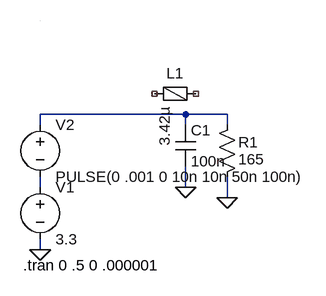
[diagram p0: schematic Draft2.asc]
Draft2.asc, the LTspice schematic file:
Version 4
SHEET 1 880 680
WIRE 224 144 0 144
WIRE 288 144 224 144
WIRE 0 160 0 144
WIRE 224 160 224 144
WIRE 288 160 288 144
WIRE 0 256 0 240
WIRE 224 256 224 224
WIRE 288 272 288 240
WIRE 0 352 0 336
WIRE 0 0 0 0
FLAG 288 272 0
FLAG 0 352 0
FLAG 224 256 0
SYMBOL FerriteBead 208 112 R90
WINDOW 0 -16 0 VBottom 2
SYMATTR InstName L1
SYMATTR Value 3.42µ
SYMATTR SpiceLine Ipk=0.2 Rser=0.6 Rpar=2780 Cpar=970f mfg="Würth Elektronik" pn="742792093 WE-CBF 0805"
SYMBOL res 272 256 M180
WINDOW 0 33 69 Left 2
WINDOW 3 33 43 Left 2
SYMATTR InstName R1
SYMATTR Value 165
SYMBOL voltage 0 240 R0
SYMATTR InstName V1
SYMATTR Value 3.3
SYMBOL voltage 0 144 R0
WINDOW 123 0 0 Left 0
WINDOW 39 0 0 Left 0
SYMATTR InstName V2
SYMATTR Value PULSE(0 .001 0 10n 10n 50n 100n)
SYMBOL cap 208 160 R0
SYMATTR InstName C1
SYMATTR Value 100n
TEXT -26 376 Left 2 !.tran 0 .5 0 .000001

The netlist it stands for:
* Draft2.asc
L1 NC_01 NC_02 3.42µ Ipk=0.2 Rser=0.6 Rpar=2780 Cpar=970f mfg="Würth Elektronik" pn="742792093 WE-CBF 0805"
R1 0 N001 165
V1 N002 0 3.3
V2 N001 N002 PULSE(0 .001 0 10n 10n 50n 100n)
C1 N001 0 100n
.tran 0 .5 0 .000001
.backanno
.end